# EasyEDA schematic cRamageddon.json
TITLE: cRamageddon; REV: 1.1; Date: 2023-01-16; Sheet: 1/1; Company: FRC #4855 Ramageddon
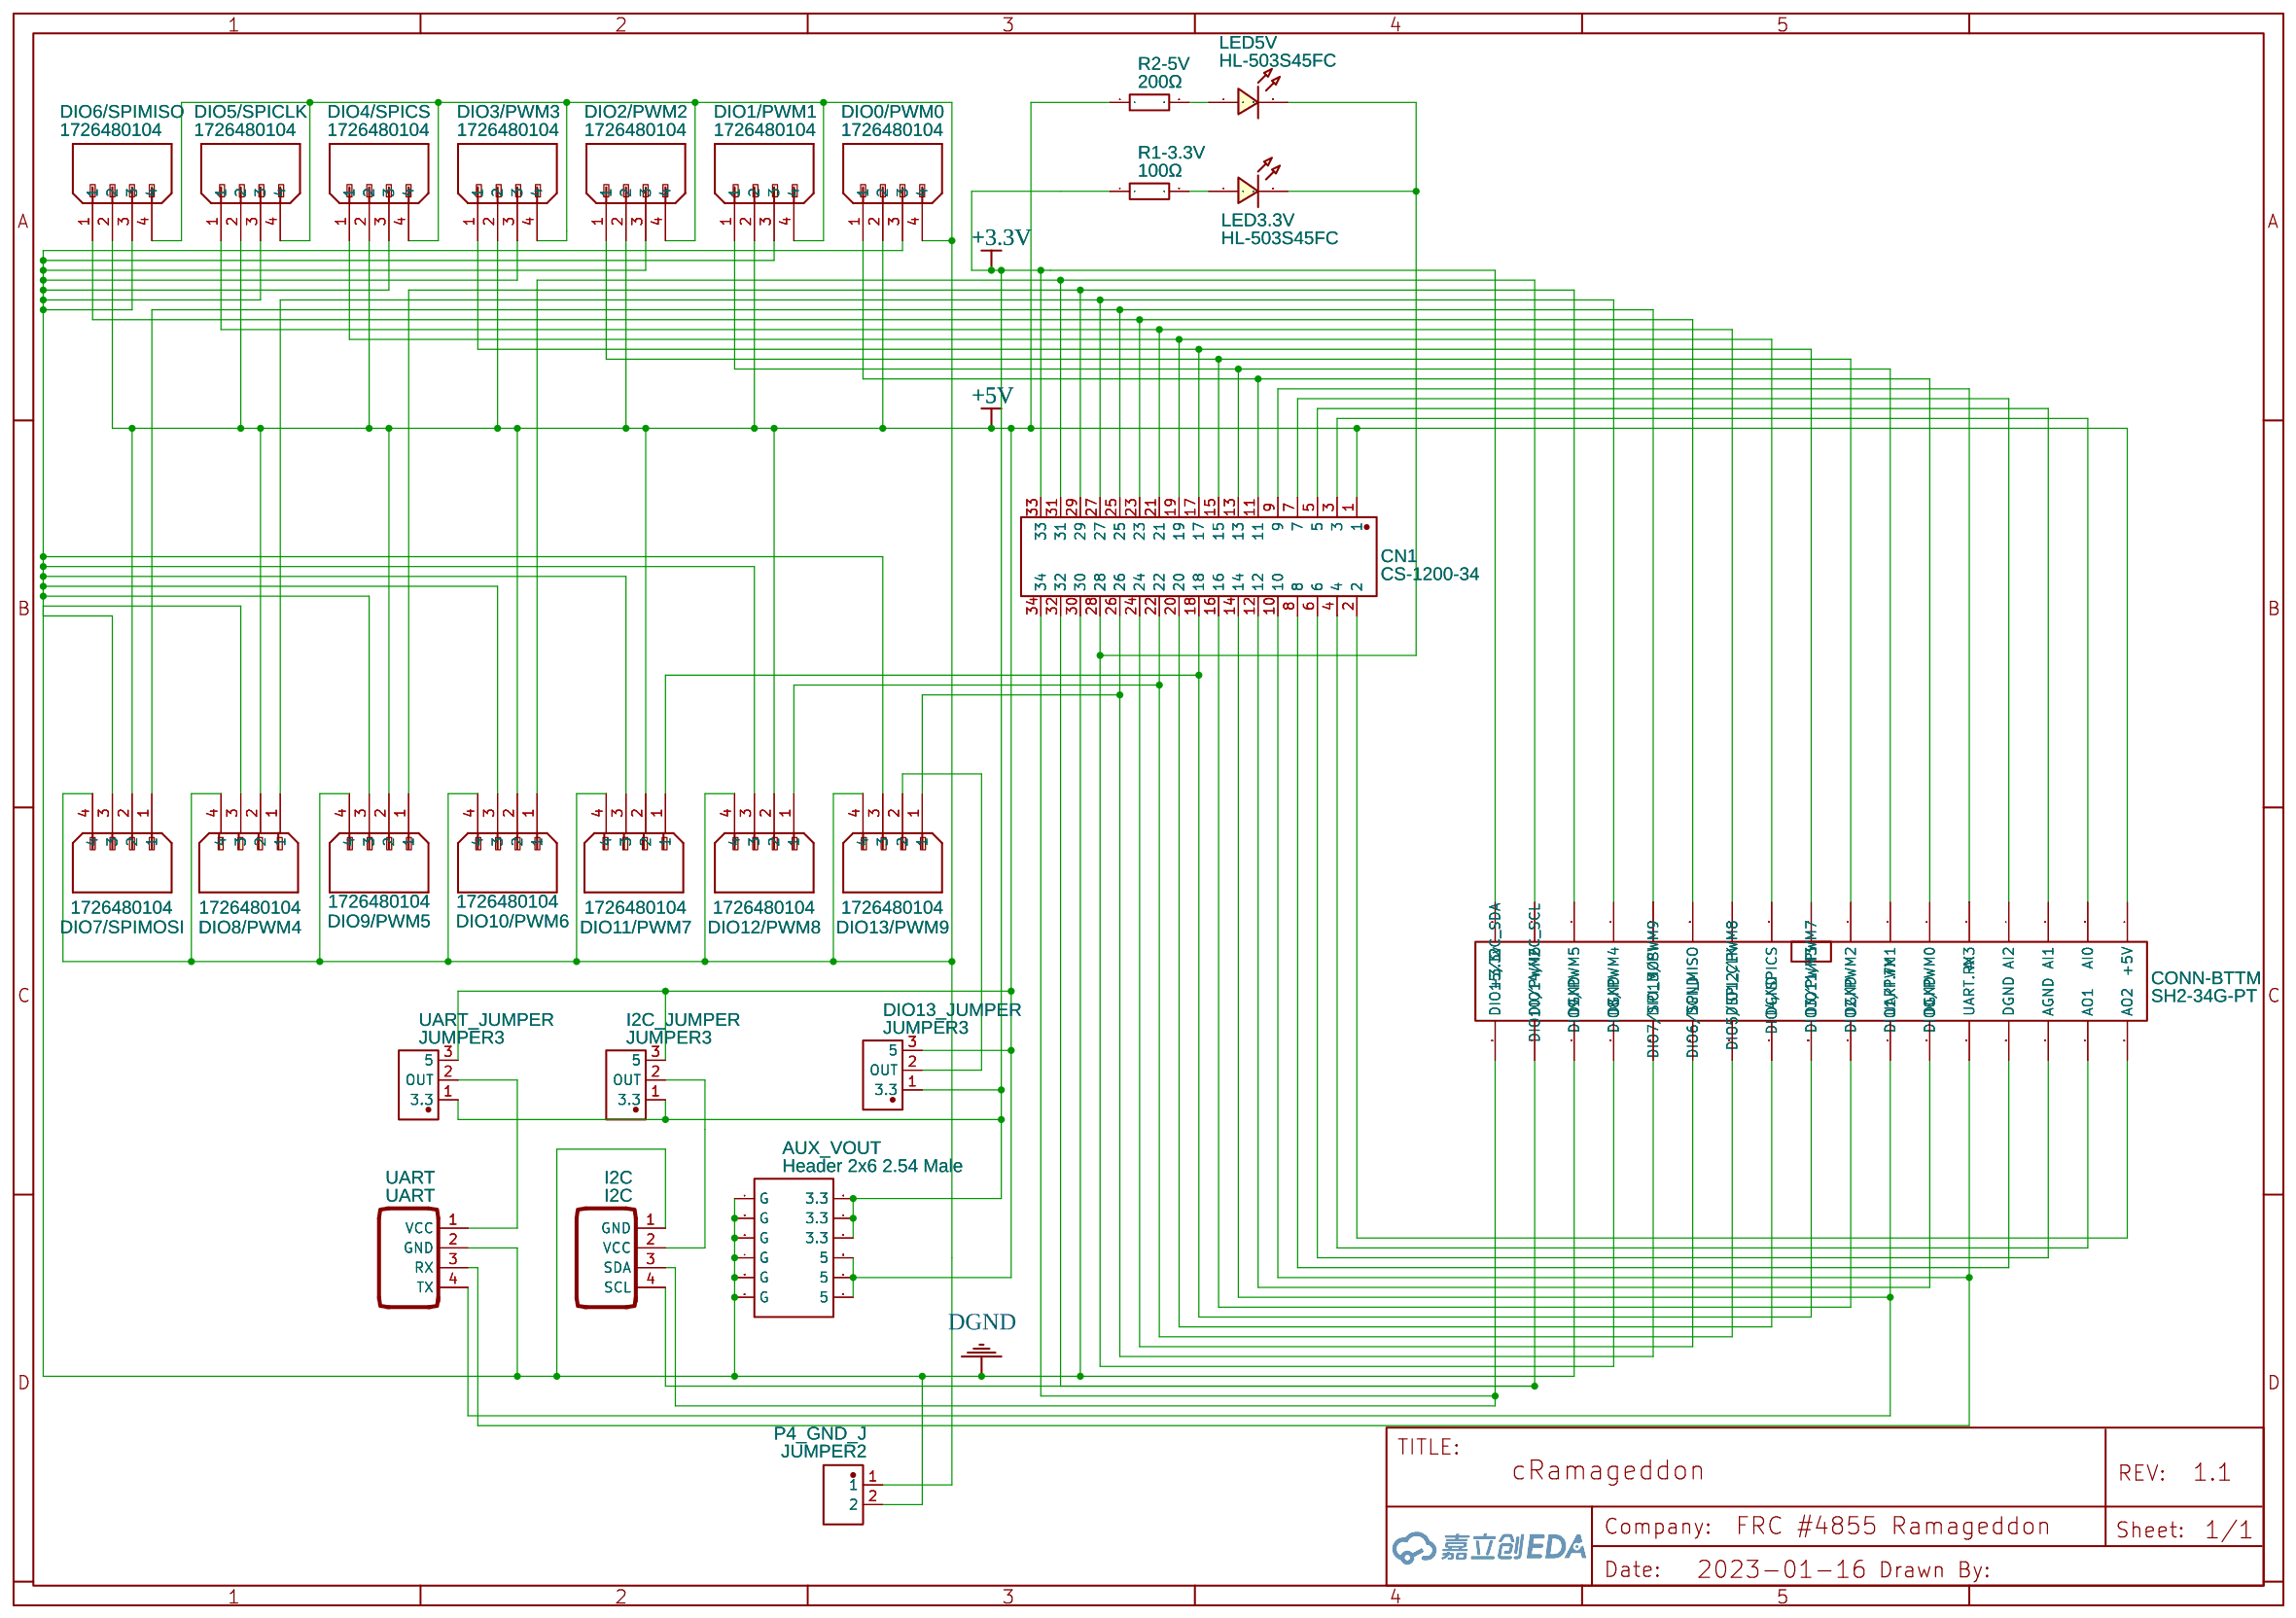
[diagram p0: schematic sheet]

## Parts
AUX_VOUT  Header 2x6 2.54 Male  [HEADER 2X6 2.54 MALE]
CN1  CS-1200-34  [CONN-TH_34P-P2.54_CST_CS-1200-34]
CONN-BTTM  SH2-34G-PT  [SBH11-PBPC-D17-ST-BK]
DIO0/PWM0  1726480104  [MOLEX_1726480104]
DIO1/PWM1  1726480104  [MOLEX_1726480104]
DIO2/PWM2  1726480104  [MOLEX_1726480104]
DIO3/PWM3  1726480104  [MOLEX_1726480104]
DIO4/SPICS  1726480104  [MOLEX_1726480104]
DIO5/SPICLK  1726480104  [MOLEX_1726480104]
DIO6/SPIMISO  1726480104  [MOLEX_1726480104]
DIO7/SPIMOSI  1726480104  [MOLEX_1726480104]
DIO8/PWM4  1726480104  [MOLEX_1726480104]
DIO9/PWM5  1726480104  [MOLEX_1726480104]
DIO10/PWM6  1726480104  [MOLEX_1726480104]
DIO11/PWM7  1726480104  [MOLEX_1726480104]
DIO12/PWM8  1726480104  [MOLEX_1726480104]
DIO13/PWM9  1726480104  [MOLEX_1726480104]
DIO13_JUMPER  JUMPER3  [HDR-TH_3P-P2.54-V-M-A]
I2C  I2C  [I2C]
I2C_JUMPER  JUMPER3  [HDR-TH_3P-P2.54-V-M-A]
LED3.3V  HL-503S45FC  [LED-TH_BD5.0-P2.54-FD]
LED5V  HL-503S45FC  [LED-TH_BD5.0-P2.54-FD]
P4_GND_J  JUMPER2  [HDR-TH_2P-P2.54-V-M-1]
R1-3.3V  100Ω  [RES-TH_BD2.5-L6.5-P10.50-D0.6]
R2-5V  200Ω  [RES-TH_BD2.5-L6.5-P10.50-D0.6]
UART  UART  [I2C]
UART_JUMPER  JUMPER3  [HDR-TH_3P-P2.54-V-M-A]

## Library data of the parts
AUX_VOUT = Header 2x6 2.54 Male: Supplier Part: 2X5/2.54; Contributor: minhtai
CN1 = CS-1200-34: Supplier: LCSC; Supplier Part: C2886707; Manufacturer: CST(永丰盈); Contributor: LCSC; JLCPCB Part Class: Extended Part
CONN-BTTM = SH2-34G-PT: Manufacturer: On Shore Technology Inc.; Supplier: Digi-Key; link: https://www.digikey.com/en/products/detail/on-shore-technology-inc/SH2-34G-PT/4453753; Contributor: Dt77
DIO0/PWM0 DIO1/PWM1 DIO2/PWM2 DIO3/PWM3 DIO4/SPICS DIO5/SPICLK DIO6/SPIMISO DIO7/SPIMOSI DIO8/PWM4 DIO9/PWM5 DIO10/PWM6 DIO11/PWM7 DIO12/PWM8 DIO13/PWM9 = 1726480104: Contributor: cheeseshark
DIO13_JUMPER I2C_JUMPER UART_JUMPER = JUMPER3: Supplier: LCSC; Supplier Part: C2940050; Manufacturer: null; Manufacturer Part: Jumper3; Contributor: LCSC; JLCPCB Part Class: Extended Part
I2C UART = I2C: Supplier Part: Módulo para LCD; Contributor: ranvelamarin
LED3.3V LED5V = HL-503S45FC: Supplier: LCSC; Supplier Part: C568942; Manufacturer: HONGLITRONIC(鸿利光电); Contributor: LCSC; JLCPCB Part Class: Extended Part
P4_GND_J = JUMPER2: Supplier: LCSC; Supplier Part: C2940092; Manufacturer: null; Manufacturer Part: Jumper2; Contributor: LCSC; JLCPCB Part Class: Extended Part
R1-3.3V R2-5V = MFR0W4F1800A50: Supplier: LCSC; Manufacturer: UNI-ROYAL(厚声); Supplier Part: C58665; Resistance (Ohms): 180; JLCPCB Part Class: Extended Part

## Nets
+3.3V: AUX_VOUT.2(3.3) AUX_VOUT.4(3.3) AUX_VOUT.6(3.3) CN1.33 CONN-BTTM.33(+3.3v) DIO13_JUMPER.1(3.3) I2C_JUMPER.1(3.3) R1-3.3V.1 UART_JUMPER.1(3.3)
+5V: AUX_VOUT.8(5) AUX_VOUT.10(5) AUX_VOUT.12(5) CN1.1 CONN-BTTM.1(+5V) DIO0/PWM0.2 DIO1/PWM1.2 DIO2/PWM2.2 DIO3/PWM3.2 DIO4/SPICS.2 DIO5/SPICLK.2 DIO6/SPIMISO.2 DIO7/SPIMOSI.2 DIO8/PWM4.2 DIO9/PWM5.2 DIO10/PWM6.2 DIO11/PWM7.2 DIO12/PWM8.2 DIO13_JUMPER.3(5) I2C_JUMPER.3(5) R2-5V.1 UART_JUMPER.3(5)
DGND: AUX_VOUT.1(G) AUX_VOUT.3(G) AUX_VOUT.5(G) AUX_VOUT.7(G) AUX_VOUT.9(G) AUX_VOUT.11(G) CN1.30 CONN-BTTM.30(DGND) DIO0/PWM0.3 DIO1/PWM1.3 DIO2/PWM2.3 DIO3/PWM3.3 DIO4/SPICS.3 DIO5/SPICLK.3 DIO6/SPIMISO.3 DIO9/PWM5.3 DIO10/PWM6.3 DIO11/PWM7.3 DIO12/PWM8.3 DIO13/PWM9.3 I2C.1(GND) P4_GND_J.2 UART.2(GND)
Net-(CN1-2): CN1.2 CONN-BTTM.2(AO2)
Net-(CN1-3): CN1.3 CONN-BTTM.3(AI0)
Net-(CN1-4): CN1.4 CONN-BTTM.4(AO1)
Net-(CN1-5): CN1.5 CONN-BTTM.5(AI1)
Net-(CN1-6): CN1.6 CONN-BTTM.6(AGND)
Net-(CN1-7): CN1.7 CONN-BTTM.7(AI2)
Net-(CN1-8): CN1.8 CONN-BTTM.8(DGND)
Net-(CN1-9): CN1.9 CONN-BTTM.9(AI3)
Net-(CN1-10): CN1.10 CONN-BTTM.10(UART.RX) UART.3(RX)
Net-(CN1-11): CN1.11 CONN-BTTM.11(DIO0/PWM0) DIO0/PWM0.1
Net-(CN1-12): CN1.12 CONN-BTTM.12(DGND)
Net-(CN1-13): CN1.13 CONN-BTTM.13(DIO1/PWM1) DIO1/PWM1.1
Net-(CN1-14): CN1.14 CONN-BTTM.14(UART.TX) UART.4(TX)
Net-(CN1-15): CN1.15 CONN-BTTM.15(DIO2/PWM2) DIO2/PWM2.1
Net-(CN1-16): CN1.16 CONN-BTTM.16(DGND)
Net-(CN1-17): CN1.17 CONN-BTTM.17(DIO3/PWM3) DIO3/PWM3.1
Net-(CN1-18): CN1.18 CONN-BTTM.18(DIO11/PWM7) DIO11/PWM7.1
Net-(CN1-19): CN1.19 CONN-BTTM.19(DIO4/SPICS) DIO4/SPICS.1
Net-(CN1-20): CN1.20 CONN-BTTM.20(DGND)
Net-(CN1-21): CN1.21 CONN-BTTM.21(DIO5/SPI CLK) DIO5/SPICLK.1
Net-(CN1-22): CN1.22 CONN-BTTM.22(DIO12/PWM8) DIO12/PWM8.1
Net-(CN1-23): CN1.23 CONN-BTTM.23(DIO6/SPI MISO) DIO6/SPIMISO.1
Net-(CN1-24): CN1.24 CONN-BTTM.24(DGND)
Net-(CN1-25): CN1.25 CONN-BTTM.25(DIO7/SPI MOSI) DIO7/SPIMOSI.1
Net-(CN1-26): CN1.26 CONN-BTTM.26(DIO13/PWM9) DIO13/PWM9.1
Net-(CN1-27): CN1.27 CONN-BTTM.27(DIO8/PWM4) DIO8/PWM4.1
Net-(CN1-28): CN1.28 CONN-BTTM.28(DGND) LED3.3V.2 LED5V.2
Net-(CN1-29): CN1.29 CONN-BTTM.29(DIO9/PWM5) DIO9/PWM5.1
Net-(CN1-31): CN1.31 CONN-BTTM.31(DIO10/PWM6) DIO10/PWM6.1
Net-(CN1-32): CN1.32 CONN-BTTM.32(DIO14/I2C SCL) I2C.4(SCL)
Net-(CN1-34): CN1.34 CONN-BTTM.34(DIO15/I2C SDA) I2C.3(SDA)
Net-(DIO0/PWM0-4): DIO0/PWM0.4 DIO1/PWM1.4 DIO2/PWM2.4 DIO3/PWM3.4 DIO4/SPICS.4 DIO5/SPICLK.4 DIO6/SPIMISO.4 DIO7/SPIMOSI.4 DIO8/PWM4.4 DIO9/PWM5.4 DIO10/PWM6.4 DIO11/PWM7.4 DIO12/PWM8.4 DIO13/PWM9.4 P4_GND_J.1
Net-(DIO7/SPIMOSI-3): DIO7/SPIMOSI.3 DIO8/PWM4.3
Net-(DIO13/PWM9-2): DIO13/PWM9.2 DIO13_JUMPER.2(OUT)
Net-(I2C-2): I2C.2(VCC) I2C_JUMPER.2(OUT)
Net-(LED3.3V-1): LED3.3V.1 R1-3.3V.2
Net-(LED5V-1): LED5V.1 R2-5V.2
Net-(UART-1): UART.1(VCC) UART_JUMPER.2(OUT)
